# Altium schematic sheet dsau-micro-zed.SchDoc: dSAU Motherboard - MicroZed
size Letter; Engineer: Christopher J. Woodall; Organization: Boston University EDF/ECE; DocumentNumber: 7; Revision: A; SheetNumber: 7; SheetTotal: 10; EMAIL: cwoodall@bu.edu; TeamName: Team 19; ProjectName: dSAU
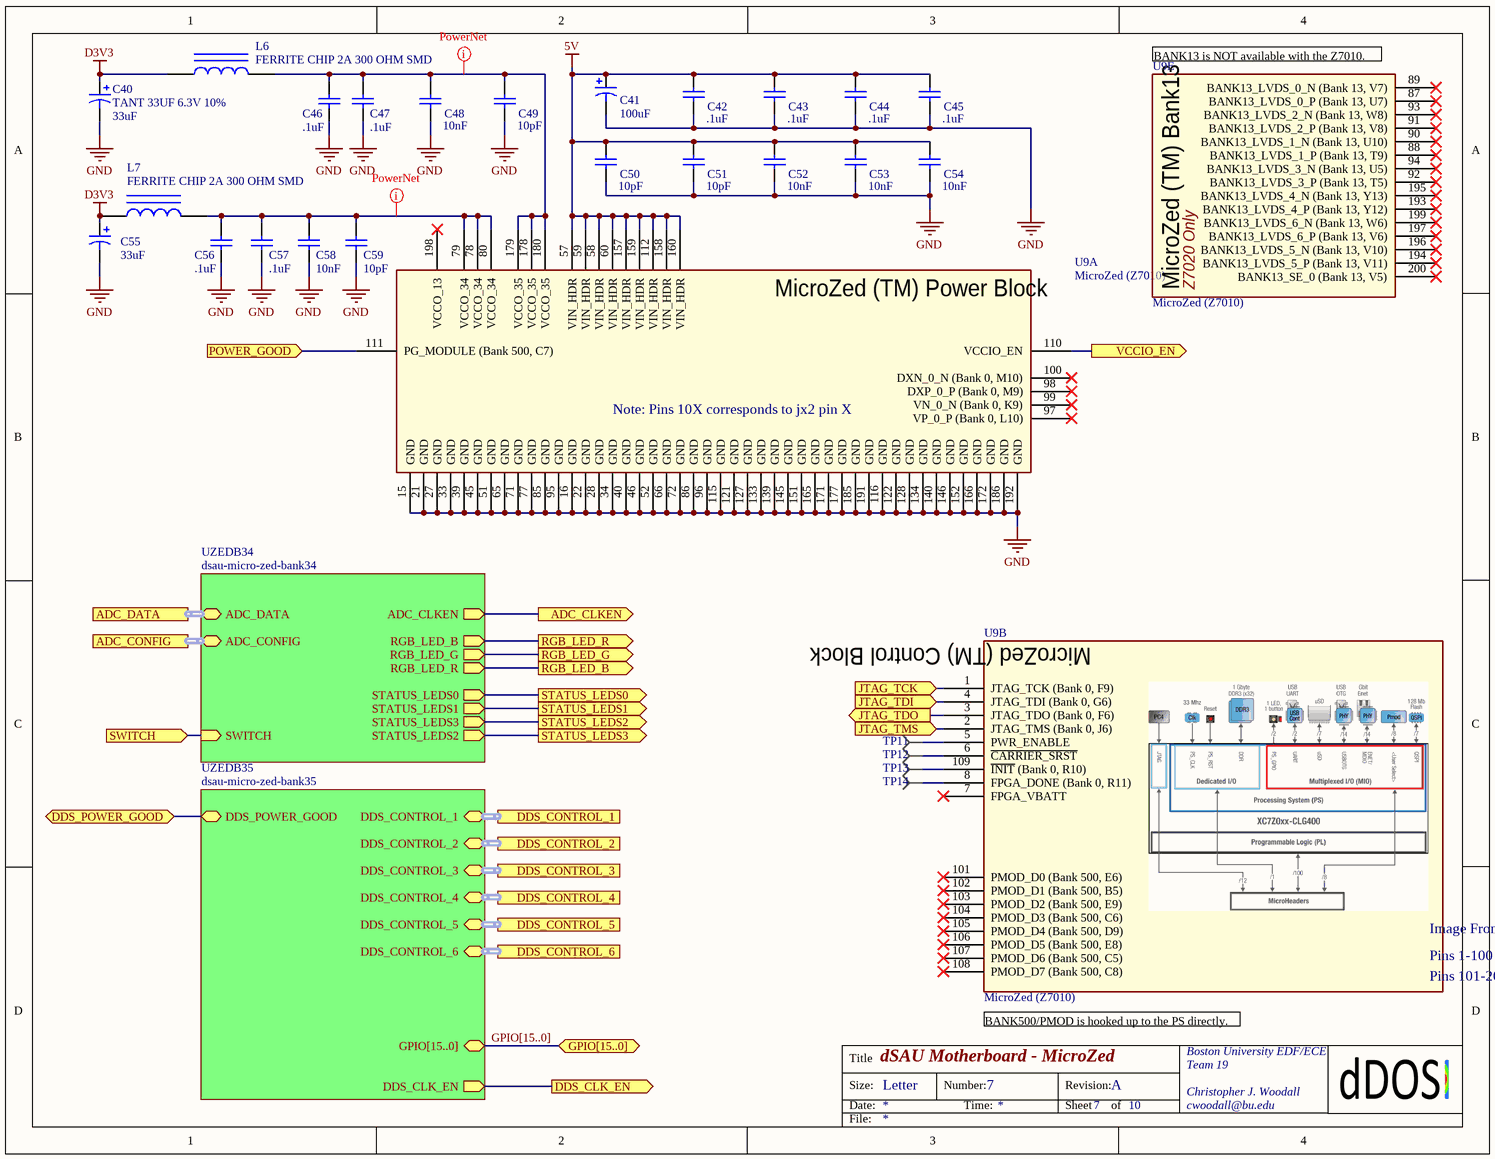
[diagram p0: dsau-micro-zed.SchDoc]

## Parts
C40  TANT 33UF 6.3V 10%  value 33uF  [CAPC2012L]
C41  value 100uF  [CAPPOL3216]  (hidden comment: TANT 100UF 10V 20%)
C42  value .1uF  [CAPC1608L]  (hidden comment: CER 0.1UF 50V Y5V)
C43  value .1uF  [CAPC1608L]  (hidden comment: CER 0.1UF 50V Y5V)
C44  value .1uF  [CAPC1608L]  (hidden comment: CER 0.1UF 50V Y5V)
C45  value .1uF  [CAPC1608L]  (hidden comment: CER 0.1UF 50V Y5V)
C46  value .1uF  [CAPC1608L]  (hidden comment: CER 0.1UF 50V Y5V)
C47  value .1uF  [CAPC1608L]  (hidden comment: CER 0.1UF 50V Y5V)
C48  value 10nF  [CAPC1608L]  (hidden comment: CER 10NF 25V 10% NP0)
C49  value 10pF  [CAPC1608L]  (hidden comment: CER 10PF 50V 5% NP0)
C50  value 10pF  [CAPC1608L]  (hidden comment: CER 10PF 50V 5% NP0)
C51  value 10pF  [CAPC1608L]  (hidden comment: CER 10PF 50V 5% NP0)
C52  value 10nF  [CAPC1608L]  (hidden comment: CER 10NF 25V 10% NP0)
C53  value 10nF  [CAPC1608L]  (hidden comment: CER 10NF 25V 10% NP0)
C54  value 10nF  [CAPC1608L]  (hidden comment: CER 10NF 25V 10% NP0)
C55  value 33uF  [CAPC2012L]  (hidden comment: TANT 33UF 6.3V 10%)
C56  value .1uF  [CAPC1608L]  (hidden comment: CER 0.1UF 50V Y5V)
C57  value .1uF  [CAPC1608L]  (hidden comment: CER 0.1UF 50V Y5V)
C58  value 10nF  [CAPC1608L]  (hidden comment: CER 10NF 25V 10% NP0)
C59  value 10pF  [CAPC1608L]  (hidden comment: CER 10PF 50V 5% NP0)
L6  FERRITE CHIP 2A 300 OHM SMD  [INDC1608L]
L7  FERRITE CHIP 2A 300 OHM SMD  [INDC1608L]
TP11  TESTPOINT_CW  [PIN1]  (value not drawn)
TP12  TESTPOINT_CW  [PIN1]  (value not drawn)
TP13  TESTPOINT_CW  [PIN1]  (value not drawn)
TP14  TESTPOINT_CW  [PIN1]  (value not drawn)
U9  MicroZed (Z7010)  [MicroZed_MatingSide]  (parts A,B,E of 5)

## Sub-sheets
UZEDB34 = dsau-micro-zed-bank34: ADC_DATA (harness ADS62P49_LVDSDDR), ADC_CONFIG (harness ADS62P49_SPI_CONFIG), ADC_CLKEN (out), RGB_LED_B (out), RGB_LED_G (out), RGB_LED_R (out), SWITCH (in), STATUS_LEDS0 (out), STATUS_LEDS1 (out), STATUS_LEDS3 (out), STATUS_LEDS2 (out)
UZEDB35 = dsau-micro-zed-bank35: DDS_CONTROL_1 (harness DDS_CONNECTOR), DDS_CONTROL_2 (harness DDS_CONNECTOR), DDS_CONTROL_3 (harness DDS_CONNECTOR), DDS_CONTROL_4 (harness DDS_CONNECTOR), DDS_CONTROL_5 (harness DDS_CONNECTOR), DDS_CONTROL_6 (harness DDS_CONNECTOR), DDS_CLK_EN (out), GPIO[15..0] (bidir), DDS_POWER_GOOD

## Ports
ADC_CLKEN (out), ADC_CONFIG (harness ADS62P49_SPI_CONFIG), ADC_DATA (harness ADS62P49_LVDSDDR), DDS_CLK_EN (out), DDS_CONTROL_1 (harness DDS_CONNECTOR), DDS_CONTROL_2 (harness DDS_CONNECTOR), DDS_CONTROL_3 (harness DDS_CONNECTOR), DDS_CONTROL_4 (harness DDS_CONNECTOR), DDS_CONTROL_5 (harness DDS_CONNECTOR), DDS_CONTROL_6 (harness DDS_CONNECTOR), DDS_POWER_GOOD, GPIO[15..0] (bidir), JTAG_TCK (in), JTAG_TDI (in), JTAG_TDO (out), JTAG_TMS (in), POWER_GOOD (in), RGB_LED_B (out), RGB_LED_G (out), RGB_LED_R (out), STATUS_LEDS0 (out), STATUS_LEDS1 (out), STATUS_LEDS2 (out), STATUS_LEDS3 (out), SWITCH (in), VCCIO_EN (out)

## Nets
5V: C41.1 C42.1 C43.1 C44.1 C45.1 C50.1 C51.1 C52.1 C53.1 C54.1 U9.57(VIN_HDR) U9.58(VIN_HDR) U9.59(VIN_HDR) U9.60(VIN_HDR) U9.112(VIN_HDR) U9.157(VIN_HDR) U9.158(VIN_HDR) U9.159(VIN_HDR) U9.160(VIN_HDR)
D3V3: C40.1 C55.1 L6.1 L7.1
GND: C40.2 C41.2 C42.2 C43.2 C44.2 C45.2 C46.2 C47.2 C48.2 C49.2 C50.2 C51.2 C52.2 C53.2 C54.2 C55.2 C56.2 C57.2 C58.2 C59.2 U9.15(GND) U9.16(GND) U9.21(GND) U9.22(GND) U9.27(GND) U9.28(GND) U9.33(GND) U9.34(GND) U9.39(GND) U9.40(GND) U9.45(GND) U9.46(GND) U9.51(GND) U9.52(GND) U9.65(GND) U9.66(GND) U9.71(GND) U9.72(GND) U9.77(GND) U9.85(GND) U9.86(GND) U9.95(GND) U9.96(GND) U9.115(GND) U9.116(GND) U9.121(GND) U9.122(GND) U9.127(GND) U9.128(GND) U9.133(GND) U9.134(GND) U9.139(GND) U9.140(GND) U9.145(GND) U9.146(GND) U9.151(GND) U9.152(GND) U9.165(GND) U9.166(GND) U9.171(GND) U9.172(GND) U9.177(GND) U9.185(GND) U9.186(GND) U9.191(GND) U9.192(GND)
ADC_CLKEN: port ADC_CLKEN, sheet UZEDB34/ADC_CLKEN
DDS_CLK_EN: port DDS_CLK_EN, sheet UZEDB35/DDS_CLK_EN
DDS_POWER_GOOD: port DDS_POWER_GOOD, sheet UZEDB35/DDS_POWER_GOOD
JTAG_TCK: U9.1(JTAG_TCK_(Bank_0,_F9)) ; port JTAG_TCK
JTAG_TDI: U9.4(JTAG_TDI_(Bank_0,_G6)) ; port JTAG_TDI
JTAG_TDO: U9.3(JTAG_TDO_(Bank_0,_F6)) ; port JTAG_TDO
JTAG_TMS: U9.2(JTAG_TMS_(Bank_0,_J6)) ; port JTAG_TMS
POWER_GOOD: U9.111(PG_MODULE_(Bank_500,_C7)) ; port POWER_GOOD
RGB_LED_B: port RGB_LED_B, sheet UZEDB34/RGB_LED_R
RGB_LED_G: port RGB_LED_G, sheet UZEDB34/RGB_LED_G
RGB_LED_R: port RGB_LED_R, sheet UZEDB34/RGB_LED_B
STATUS_LEDS0: port STATUS_LEDS0, sheet UZEDB34/STATUS_LEDS0
STATUS_LEDS1: port STATUS_LEDS1, sheet UZEDB34/STATUS_LEDS1
STATUS_LEDS2: port STATUS_LEDS2, sheet UZEDB34/STATUS_LEDS3
STATUS_LEDS3: port STATUS_LEDS3, sheet UZEDB34/STATUS_LEDS2
SWITCH: port SWITCH, sheet UZEDB34/SWITCH
VCCIO_EN: U9.110(VCCIO_EN) ; port VCCIO_EN
NetC46_1: C46.1 C47.1 C48.1 C49.1 L6.2 U9.178(VCCO_35) U9.179(VCCO_35) U9.180(VCCO_35)
NetC56_1: C56.1 C57.1 C58.1 C59.1 L7.2 U9.78(VCCO_34) U9.79(VCCO_34) U9.80(VCCO_34)
NetTP11_1: TP11.1 U9.5(PWR_ENABLE)
NetTP12_1: TP12.1 U9.6(~{CARRIER_SRST})
NetTP13_1: TP13.1 U9.109(~{INIT}_(Bank_0,_R10))
NetTP14_1: TP14.1 U9.8(FPGA_DONE_(Bank_0,_R11))

Not connected (* = marked no-connect by the designer): U9 7(FPGA_VBATT)* 87(BANK13_LVDS_0_P_(Bank_13,_U7))* 88(BANK13_LVDS_1_P_(Bank_13,_T9))* 89(BANK13_LVDS_0_N_(Bank_13,_V7))* 90(BANK13_LVDS_1_N_(Bank_13,_U10))* 91(BANK13_LVDS_2_P_(Bank_13,_V8))* 92(BANK13_LVDS_3_P_(Bank_13,_T5))* 93(BANK13_LVDS_2_N_(Bank_13,_W8))* 94(BANK13_LVDS_3_N_(Bank_13,_U5))* 97(VP_0_P_(Bank_0,_L10))* 98(DXP_0_P_(Bank_0,_M9))* 99(VN_0_N_(Bank_0,_K9))* 100(DXN_0_N_(Bank_0,_M10))* 101(PMOD_D0_(Bank_500,_E6))* 102(PMOD_D1_(Bank_500,_B5))* 103(PMOD_D2_(Bank_500,_E9))* 104(PMOD_D3_(Bank_500,_C6))* 105(PMOD_D4_(Bank_500,_D9))* 106(PMOD_D5_(Bank_500,_E8))* 107(PMOD_D6_(Bank_500,_C5))* 108(PMOD_D7_(Bank_500,_C8))* 193(BANK13_LVDS_4_P_(Bank_13,_Y12))* 194(BANK13_LVDS_5_P_(Bank_13,_V11))* 195(BANK13_LVDS_4_N_(Bank_13,_Y13))* 196(BANK13_LVDS_5_N_(Bank_13,_V10))* 197(BANK13_LVDS_6_P_(Bank_13,_V6))* 198(VCCO_13)* 199(BANK13_LVDS_6_N_(Bank_13,_W6))* 200(BANK13_SE_0_(Bank_13,_V5))*

## Buses and harness runs
bus GPIO[15..0] = port GPIO[15..0] = sheet UZEDB35/GPIO[15..0]
harness port ADC_CONFIG = sheet UZEDB34/ADC_CONFIG
harness port ADC_DATA = sheet UZEDB34/ADC_DATA
harness port DDS_CONTROL_1 = sheet UZEDB35/DDS_CONTROL_1
harness port DDS_CONTROL_2 = sheet UZEDB35/DDS_CONTROL_2
harness port DDS_CONTROL_3 = sheet UZEDB35/DDS_CONTROL_3
harness port DDS_CONTROL_4 = sheet UZEDB35/DDS_CONTROL_4
harness port DDS_CONTROL_5 = sheet UZEDB35/DDS_CONTROL_5
harness port DDS_CONTROL_6 = sheet UZEDB35/DDS_CONTROL_6

## Layout directives
net class PowerNet: NetC46_1, NetC56_1

## Notes on the sheet
- (near U9) BANK13 is NOT available with the Z7010.
- (near U9) BANK500/PMOD is hooked up to the PS directly.
- Title
- Size:
- Date:
- Letter
- Number:
- Time:
- Revision:
- Sheet
- of
- File:
- (in symbol MicroZed, part A) MicroZed (TM) Power Block; Note: Pins 10X corresponds to jx2 pin X
- (in symbol MicroZed, part B) MicroZed (TM) Control Block; Image From zedboard.org; Pins 1-100 correspond to JX1 1-100; Pins 101-200 correspond to JX2 1-100
- (in symbol MicroZed, part E) MicroZed (TM) Bank13; Z7020 Only

## Library data of the parts
C40 C55 = Cap Pol3: Polarized Capacitor (Surface Mount); Manufacturer: AVX Corporation; Manufacturer Part Number: TPSA336K006R0600; Published: 8-Jun-2000; LatestRevisionDate: 29-May-2009; LatestRevisionNote: IPC-7351 Footprint Added.; PackageReference: C1206; Publisher: Altium Limited; PackageDescription: Chip Capacitor; Supplier 1: Digi-Key; Supplier Part Number 1: 478-1755-1-ND
C41 = Cap Pol3: Polarized Capacitor (Surface Mount); Manufacturer: Vishay Sprague; Manufacturer Part Number: TL8A0107M010C; Published: 8-Jun-2000; LatestRevisionDate: 29-May-2009; LatestRevisionNote: IPC-7351 Footprint Added.; PackageReference: C1206; Publisher: Altium Limited; PackageDescription: Chip Capacitor; Supplier 1: Digi-Key; Supplier Part Number 1: 718-1921-1-ND
C42-C47 C56 C57 = Cap: Capacitor; Manufacturer: Yageo; Manufacturer Part Number: CC0603ZRY5V9BB104; Published: 8-Jun-2000; LatestRevisionDate: 17-Jul-2002; LatestRevisionNote: Re-released for DXP Platform.; PackageReference: RAD-0.3; Publisher: Altium Limited; Supplier 1: Digi-Key; Supplier Part Number 1: 311-1343-1-ND
C48 C52-C54 C58 = Cap: Capacitor; Manufacturer: Kemet; Manufacturer Part Number: C0603C103K3GACTU; Published: 8-Jun-2000; LatestRevisionDate: 17-Jul-2002; LatestRevisionNote: Re-released for DXP Platform.; PackageReference: RAD-0.3; Publisher: Altium Limited; Supplier 1: Digi-Key; Supplier Part Number 1: 399-8987-1-ND
C49-C51 C59 = Cap: Capacitor; Manufacturer: Samsung Electro-Mechanics America, Inc; Manufacturer Part Number: CL10C100JB8NCNC; Published: 8-Jun-2000; LatestRevisionDate: 17-Jul-2002; LatestRevisionNote: Re-released for DXP Platform.; PackageReference: RAD-0.3; Publisher: Altium Limited; Supplier 1: Digi-Key; Supplier Part Number 1: 1276-2154-1-ND
L6 L7 = Inductor Iron: Magnetic-Core Inductor; Manufacturer: Laird-Signal Integrity Products; Manufacturer Part Number: MI0603L301R-10; Value: 2A 300 OHM @ 100MHz; Published: 24-Mar-1999; LatestRevisionDate: 17-Jul-2002; LatestRevisionNote: Re-released for DXP Platform.; PackageReference: AXIAL-0.9; Publisher: Altium Limited; Supplier 1: Digi-Key; Supplier Part Number 1: 240-2374-1-ND
TP11-TP14 = TESTPOINT_CW: Manufacturer: Keystone; Manufacturer Part Number: 5000; Supplier 1: Digi-Key; Supplier Part Number 1: 5000K-ND
U9 = MicroZed: MicroZed is a low-cost development board based on the Xilinx Zynq-7000 All Programmable SoC. Its unique design allows it to be used as both a stand-alone evaluation board for basic SoC experimentation, or combined with a carrier card as an embeddable syst; Manufacturer: Avnet; Manfacturer Part Number: AES-Z7MB-7Z010-G; Supplier 1: Avnet; Supplier Part Number 1: AES-Z7MB-7Z010-G; Supplier 2: Mouser; Supplier Part Number 2: 649-61083-101400LF